# EAGLE board display_array (EAGLE 7.5.0), part 1 of 2
DRAWING_NUMBER: B001; DRAWN: Mario Blunk / Blunk electronic; PROJECT: DSKY; STATUS: R&D
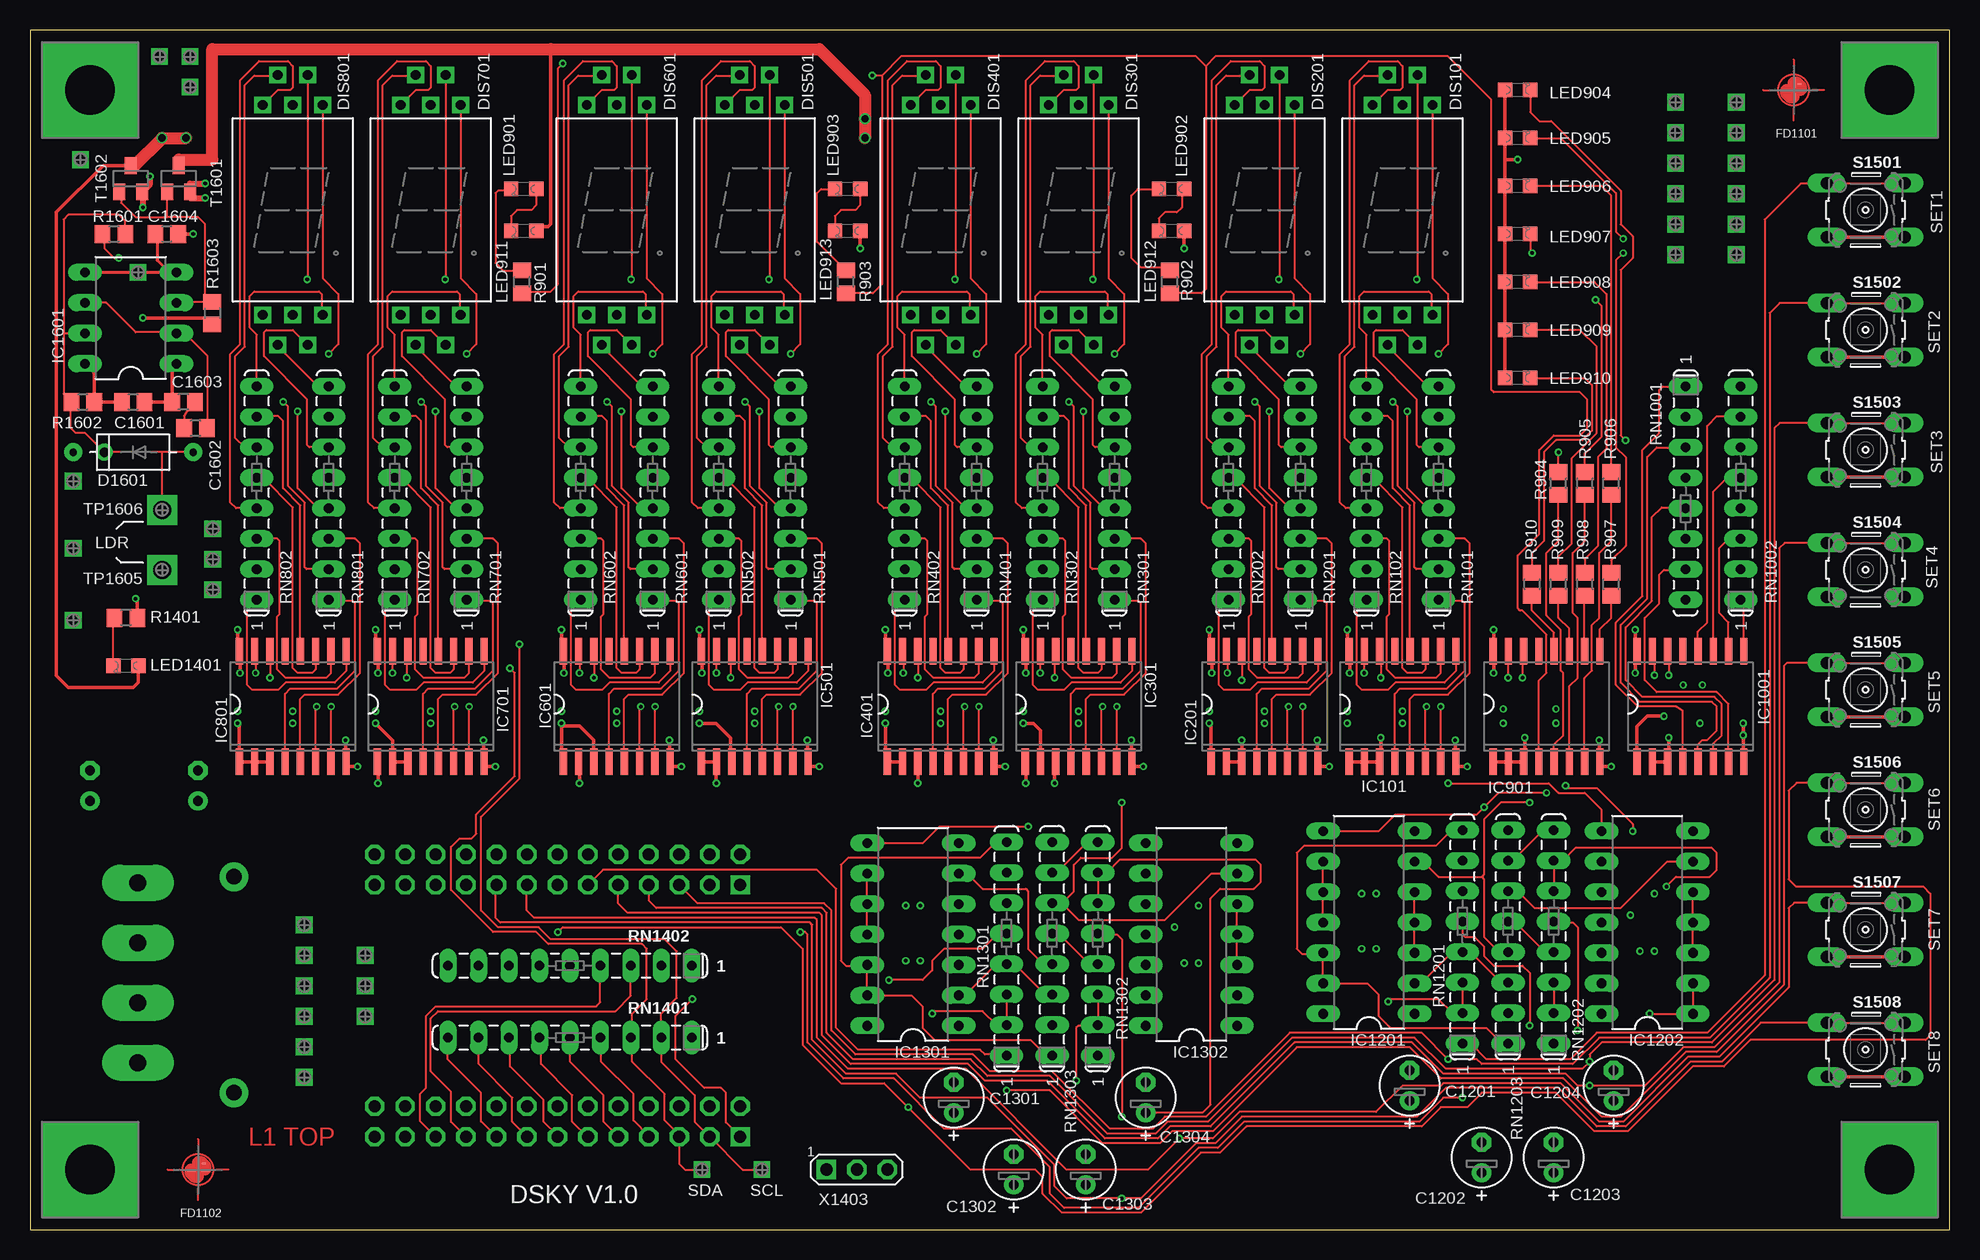
[diagram p16: board, top side]
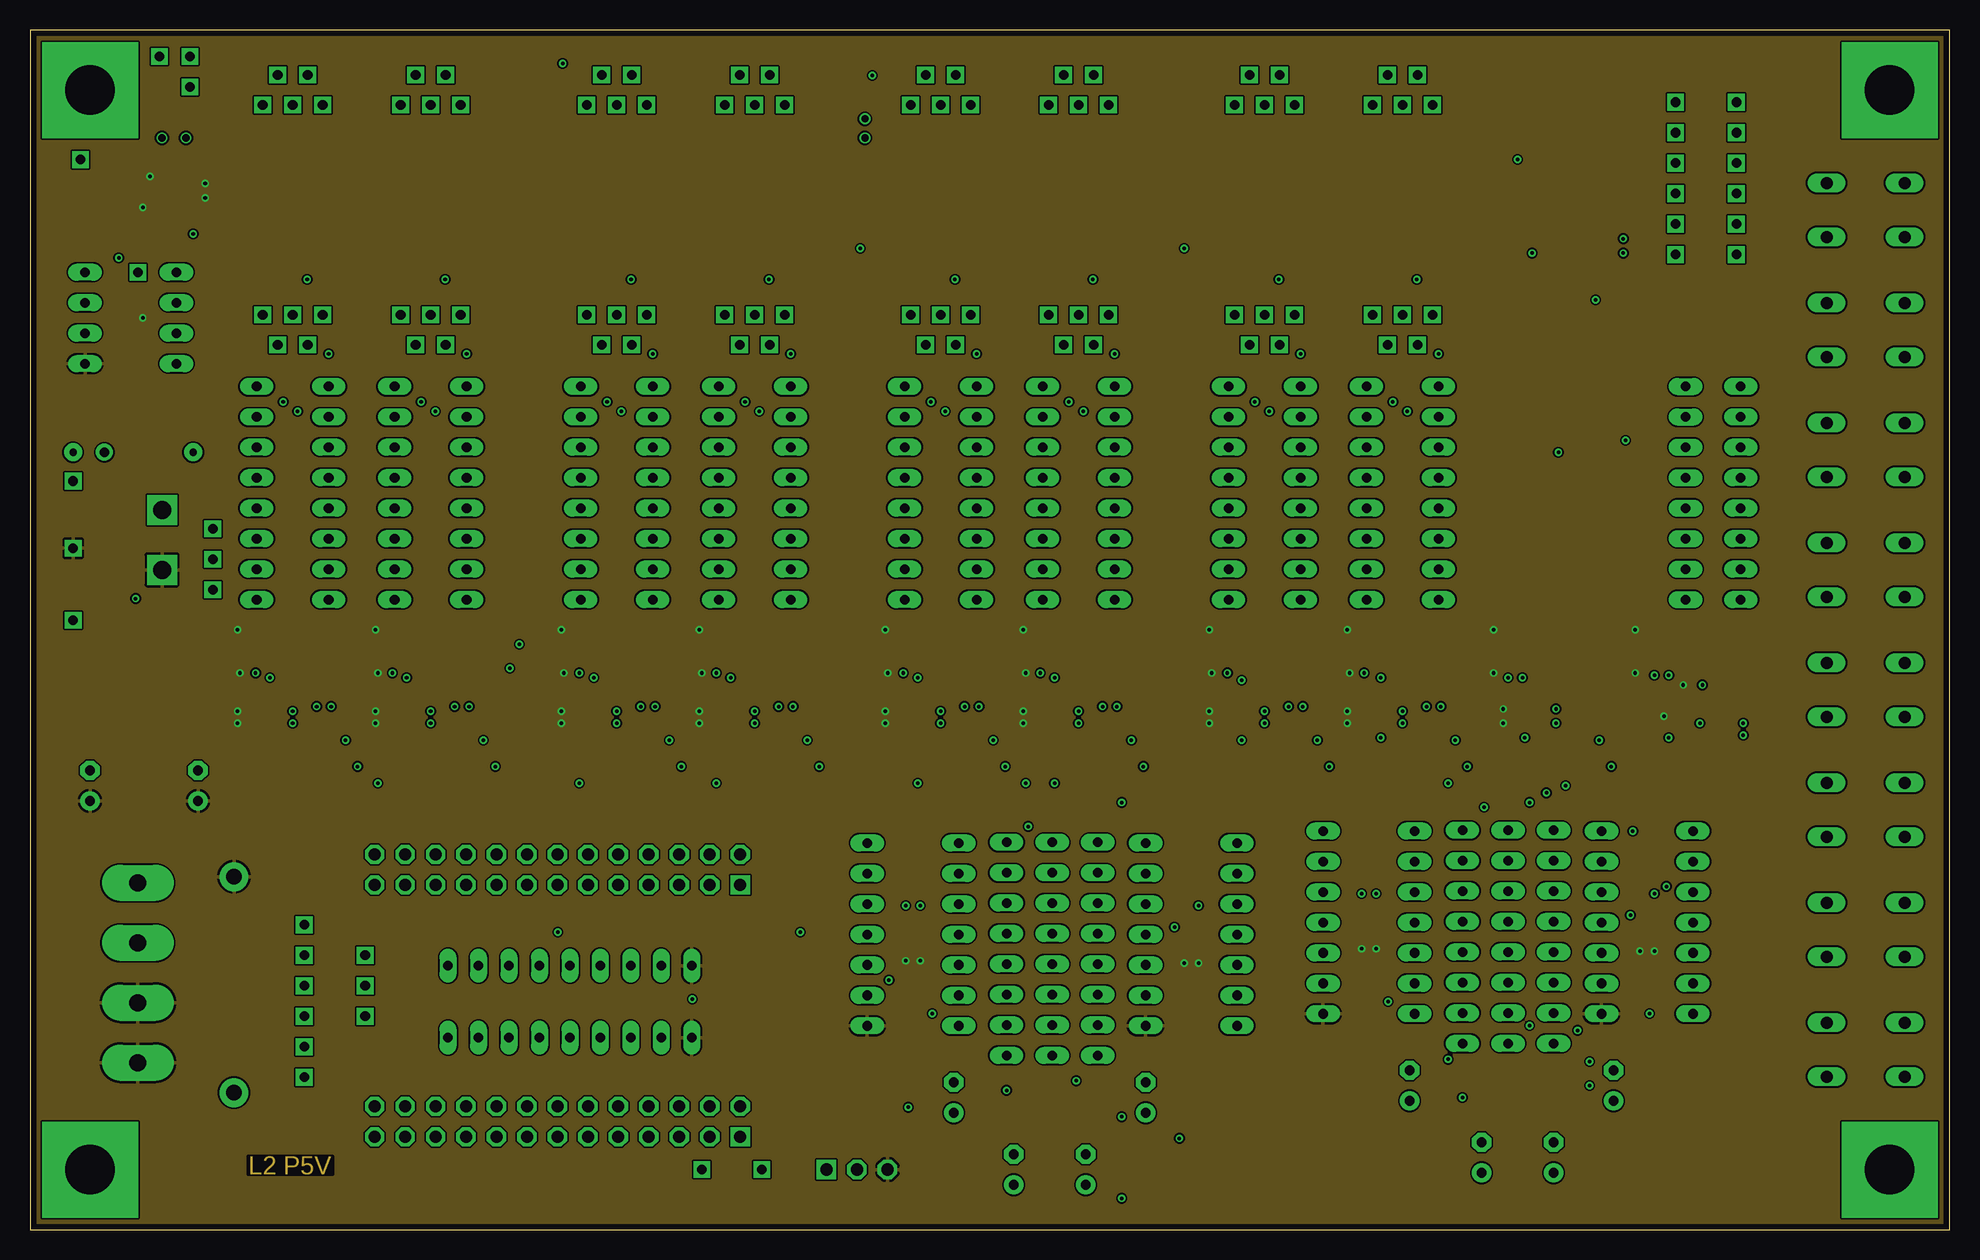
[diagram p17: board, inner layer Route2]
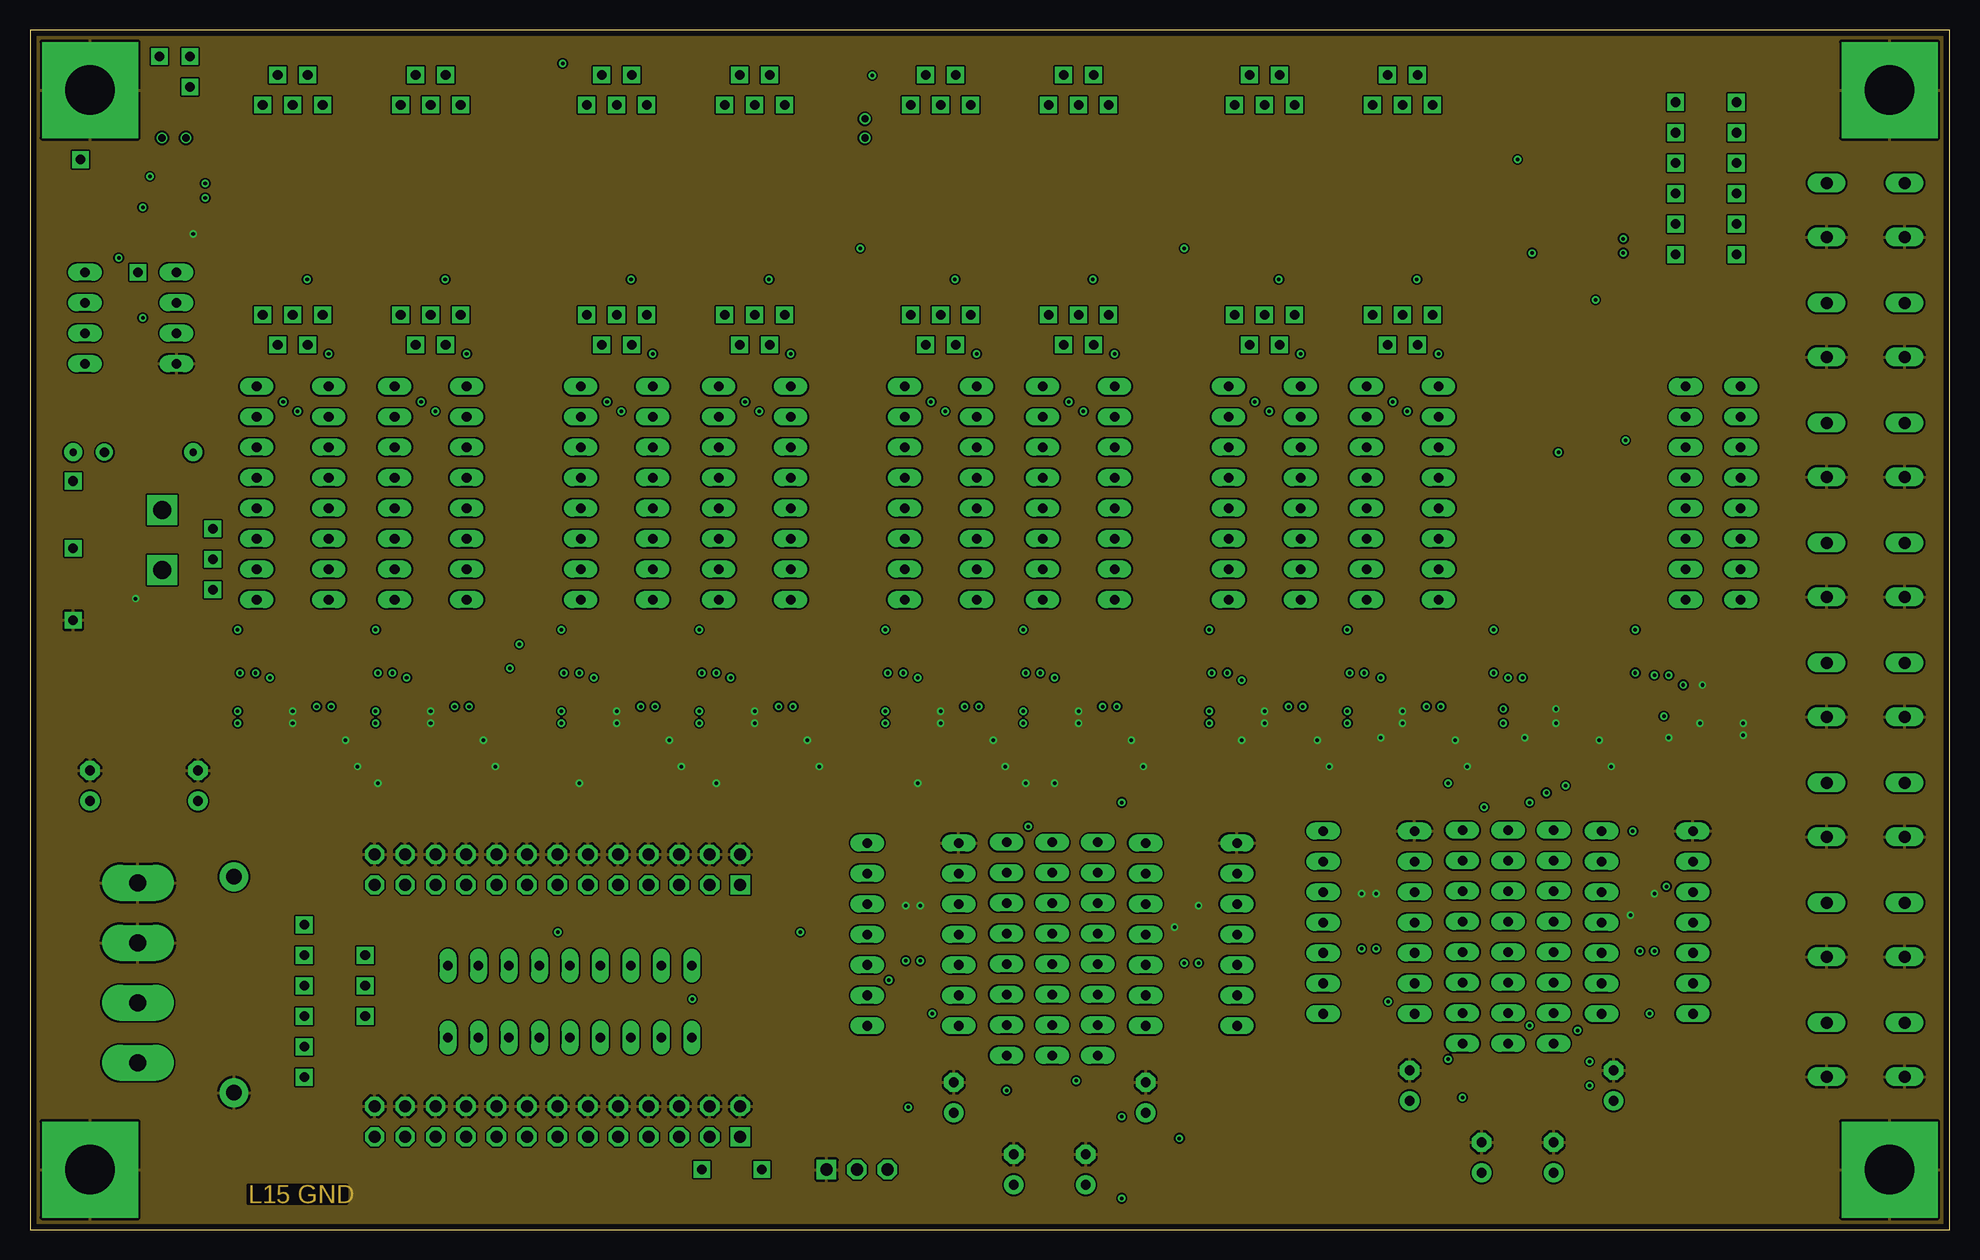
[diagram p18: board, inner layer Route15]
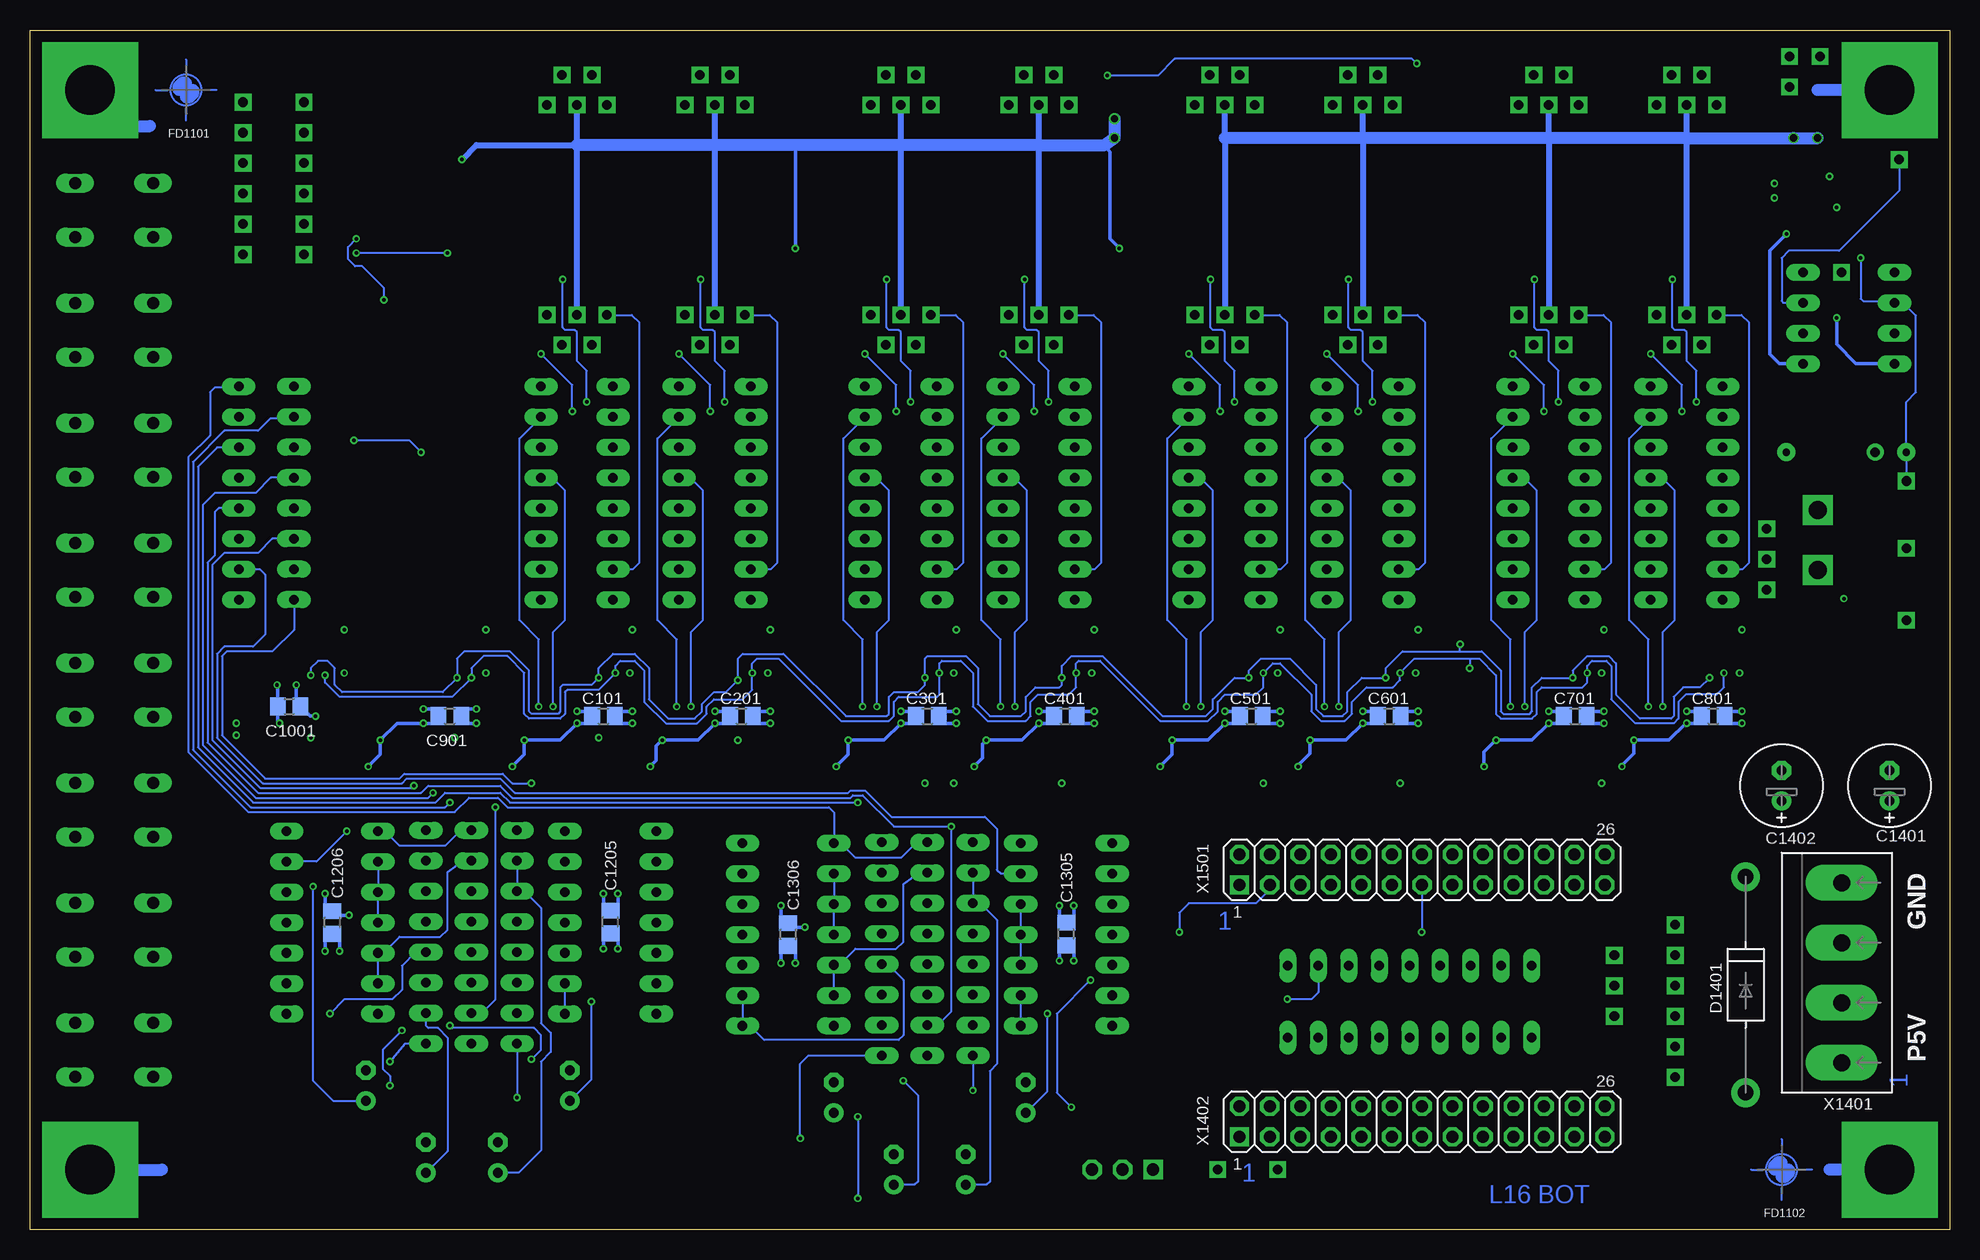
[diagram p19: board, bottom side, seen from below]

Size 160 x 100 mm. Coordinates in mm from the lower left corner, seen from the top.
Outline: 0,0 160,0 160,100 0,100 0,0
Copper layers (1+2*15+16): Top 0.018mm / dielectric 0.35mm / Route2 0.035mm / dielectric 0.65mm / Route15 0.035mm / dielectric 0.35mm / Bottom 0.018mm
Design rules "QP_ML4_std *": minimum track width 0.15mm, minimum drill 0.3mm, track to track 0.15mm, track to pad 0.15mm, pad to pad 0.15mm, via to via 0.15mm, smd to smd 0.15mm, copper to edge 0.5mm, drill to drill 0.2mm, minimum pad ring 0.3mm, minimum via ring 0.15mm, stop-mask expansion 0.1mm, vias tented up to drill 0.3mm, thermal gap 0.2mm
Net classes: 1 pwr: width 0.3 mm

## Footprints (pad centres in the part's own frame; a part is rotated, then mirrored left to right if it is on the bottom)
S_0805 = smd 1.3 x 1.5: 1 -0.95,0; 2 0.95,0
T_RADIAL_5MM_GRID_2.54MM = drill 0.8 pad 1.6: + -1.27,0 | drill 0.8 pad 1.6 octagon: - 1.27,0
T_RADIAL_7MM_GRID_2.54MM = drill 0.8 pad 1.6: + -1.27,0 | drill 0.8 pad 1.6 octagon: - 1.27,0
T_DO201_GRID_18MM = drill 1.3 pad 2.4: A -9,0; C 9,0
T_DO204_GRID_10MM = drill 0.6 pad 1.5: A -5,0; C 5,0
T_VQB71 = drill 0.8 square: 1 -2.5,-8.75; 2 -1.25,-11.25; 3 0,-8.75; 4 1.25,-11.25; 5 2.5,-8.75; 6 2.5,8.75; 7 1.25,11.25; 8 0,8.75; 9 -1.25,11.25; 10 -2.5,8.75
CROSSHAIR = smd 0.305 x 0.152: 1 0.5,0.5
4.1_PAD = drill 4.1 pad 8 square: H1 0,0
S_SOIC16 = smd 0.6 x 2.2: 1 -4.445,-4.6; 2 -3.175,-4.6; 3 -1.905,-4.6; 4 -0.635,-4.6; 5 0.635,-4.6; 6 1.905,-4.6; 7 3.175,-4.6; 8 4.445,-4.6; 9 4.445,4.6; 10 3.175,4.6; 11 1.905,4.6; 12 0.635,4.6; 13 -0.635,4.6; 14 -1.905,4.6; 15 -3.175,4.6; 16 -4.445,4.6
T_NDIP14 = drill 0.8 long: 1 -7.62,-3.81; 2 -5.08,-3.81; 3 -2.54,-3.81; 4 0,-3.81; 5 2.54,-3.81; 6 5.08,-3.81; 7 7.62,-3.81; 8 7.62,3.81; 9 5.08,3.81; 10 2.54,3.81; 11 0,3.81; 12 -2.54,3.81; 13 -5.08,3.81; 14 -7.62,3.81
T_NDIP8 = drill 0.8 long: 1 -3.82,-3.81; 2 -1.28,-3.81; 3 1.26,-3.81; 4 3.8,-3.81; 5 3.8,3.81; 6 1.26,3.81; 7 -1.28,3.81; 8 -3.82,3.81
S_0805' = smd 1.2 x 1.2: A 0,-1.05; C 0,1.05
T_SIL8 = drill 0.8 long: 1 -8.89,0; 2 -6.35,0; 3 -3.81,0; 4 -1.27,0; 5 1.27,0; 6 3.81,0; 7 6.35,0; 8 8.89,0
T_SIL9 = drill 0.8 long: 1 -10.16,0; 2 -7.62,0; 3 -5.08,0; 4 -2.54,0; 5 0,0; 6 2.54,0; 7 5.08,0; 8 7.62,0; 9 10.16,0
T_PUSH_BUTTON_6X6 = drill 1 long: 1 -3.25,2.25; 2 -3.25,-2.25; 3 3.25,2.25; 4 3.25,-2.25
S_SOT23 = smd 1 x 1.4: 1 -0.95,-1.1; 2 0.95,-1.1; 3 0,1.1
T_TEST_POINT_SMALL = drill 0.8 square: 1 0,0
T_TEST_POINT_LARGE = drill 1.5 pad 2.5 square: 1 0,0
T_WIRE_CLAMP_1X4_5MM = drill 1.4 pad 3 long: 1 -7.5,-0.02; 2 -2.5,-0.02; 3 2.5,-0.02; 4 7.5,-0.02
T_MALE_2X13_VERTICAL_GRID_2.54MM = drill 1 square: 1 -15.2,-1.27 | drill 1 octagon: 2 -15.2,1.27; 3 -12.66,-1.27; 4 -12.66,1.27; 5 -10.12,-1.27; 6 -10.12,1.27; 7 -7.58,-1.27; 8 -7.58,1.27; 9 -5.04,-1.27; 10 -5.04,1.27; 11 -2.5,-1.27; 12 -2.5,1.27; 13 0.04,-1.27; 14 0.04,1.27; 15 2.58,-1.27; 16 2.58,1.27; 17 5.12,-1.27; 18 5.12,1.27; 19 7.66,-1.27; 20 7.66,1.27; 21 10.2,-1.27; 22 10.2,1.27; 23 12.74,-1.27; 24 12.74,1.27; 25 15.28,-1.27; 26 15.28,1.27
T_MALE_3X1_VERTICAL = drill 1.016 square: 1 0,3.81 | drill 1.016 octagon: 2 0,1.27; 3 0,-1.27

## Placement (x,y rotation side)
C101  100n  [S_0805]  112.2,42.8 0 bottom
C201  100n  [S_0805]  100.7,42.8 0 bottom
C301  100n  [S_0805]  85.2,42.8 0 bottom
C401  100n  [S_0805]  73.7,42.8 0 bottom
C501  100n  [S_0805]  58.2,42.8 0 bottom
C601  100n  [S_0805]  46.7,42.8 0 bottom
C701  100n  [S_0805]  31.2,42.8 0 bottom
C801  100n  [S_0805]  19.7,42.8 0 bottom
C901  100n  [S_0805]  125,42.8 0 bottom
C1001  100n  [S_0805]  138.4,43.6 0 bottom
C1201  10u  [T_RADIAL_5MM_GRID_2.54MM]  115,12 90 top
C1202  10u  [T_RADIAL_5MM_GRID_2.54MM]  121,6 90 top
C1203  10u  [T_RADIAL_5MM_GRID_2.54MM]  127,6 90 top
C1204  10u  [T_RADIAL_5MM_GRID_2.54MM]  132,12 90 top
C1205  100n  [S_0805]  111.62,25.64 90 bottom
C1206  100n  [S_0805]  134.8,25.6 90 bottom
C1301  10u  [T_RADIAL_5MM_GRID_2.54MM]  77,11 90 top
C1302  10u  [T_RADIAL_5MM_GRID_2.54MM]  82,5 90 top
C1303  10u  [T_RADIAL_5MM_GRID_2.54MM]  88,5 90 top
C1304  10u  [T_RADIAL_5MM_GRID_2.54MM]  93,11 90 top
C1305  100n  [S_0805]  73.62,24.64 90 bottom
C1306  100n  [S_0805]  96.8,24.6 90 bottom
C1401  100u  [T_RADIAL_7MM_GRID_2.54MM]  5,37 90 bottom
C1402  100u  [T_RADIAL_7MM_GRID_2.54MM]  14,37 90 bottom
C1601  100n  [S_0805]  8.6,69 0 top
C1602  100n  [S_0805]  13.8,66.8 180 top
C1603  100n  [S_0805]  12.8,69 180 top
C1604  10n  [S_0805]  11.4,83 0 top
D1401  1N5400  [T_DO201_GRID_18MM]  17,20.4 90 bottom
D1601  BAT48  [T_DO204_GRID_10MM]  8.6,64.8 180 top
DIS101  VQB71  [T_VQB71]  114.4,85 0 top
DIS201  VQB71  [T_VQB71]  102.9,85 0 top
DIS301  VQB71  [T_VQB71]  87.4,85 0 top
DIS401  VQB71  [T_VQB71]  75.9,85 0 top
DIS501  VQB71  [T_VQB71]  60.4,85 0 top
DIS601  VQB71  [T_VQB71]  48.9,85 0 top
DIS701  VQB71  [T_VQB71]  33.4,85 0 top
DIS801  VQB71  [T_VQB71]  21.9,85 0 top
FD1101  FIDUCIAL_CROSSHAIR  [CROSSHAIR]  147,95 0 top
FD1102  FIDUCIAL_CROSSHAIR  [CROSSHAIR]  14,5 0 top
H1101  HOLE_4.1_PAD  [4.1_PAD]  5,95 0 top
H1102  HOLE_4.1_PAD  [4.1_PAD]  5,5 0 top
H1103  HOLE_4.1_PAD  [4.1_PAD]  155,5 0 top
H1104  HOLE_4.1_PAD  [4.1_PAD]  155,95 0 top
IC101  PCF8574T  [S_SOIC16]  114.4,43.6 0 top
IC201  PCF8574T  [S_SOIC16]  102.9,43.6 0 top
IC301  PCF8574T  [S_SOIC16]  87.4,43.6 0 top
IC401  PCF8574T  [S_SOIC16]  75.9,43.6 0 top
IC501  PCF8574T  [S_SOIC16]  60.4,43.6 0 top
IC601  PCF8574T  [S_SOIC16]  48.9,43.6 0 top
IC701  PCF8574T  [S_SOIC16]  33.4,43.6 0 top
IC801  PCF8574T  [S_SOIC16]  21.9,43.6 0 top
IC901  PCF8574AT  [S_SOIC16]  126.4,43.6 0 top
IC1001  PCF8574AT  [S_SOIC16]  138.4,43.6 0 top
IC1201  SN7400N  [T_NDIP14]  111.6,25.6 90 top
IC1202  SN7400N  [T_NDIP14]  134.8,25.6 90 top
IC1301  SN7400N  [T_NDIP14]  73.6,24.6 90 top
IC1302  SN7400N  [T_NDIP14]  96.8,24.6 90 top
IC1601  NE555V  [T_NDIP8]  8.4,76 90 top
LED901  red  [S_0805']  41.15,86.75 90 top
LED902  red  [S_0805']  95.15,86.75 90 top
LED903  red  [S_0805']  68.15,86.75 90 top
LED904  green  [S_0805']  124,95 270 top
LED905  green  [S_0805']  124,91 270 top
LED906  yellow  [S_0805']  124,87 270 top
LED907  yellow  [S_0805']  124,83 270 top
LED908  red  [S_0805']  124,79 270 top
LED909  blue  [S_0805']  124,75 270 top
LED910  blue  [S_0805']  124,71 270 top
LED911  red  [S_0805']  41.15,83.25 90 top
LED912  red  [S_0805']  95.15,83.25 90 top
LED913  red  [S_0805']  68.15,83.25 90 top
LED1401  green  [S_0805']  8,47 90 top
R901  1k5  [S_0805]  41,79 90 top
R902  1k5  [S_0805]  95,79 90 top
R903  1k5  [S_0805]  68,79 90 top
R904  750  [S_0805]  127.4,62.2 90 top
R905  750  [S_0805]  129.6,62.2 90 top
R906  2k2  [S_0805]  131.8,62.2 90 top
R907  2k2  [S_0805]  131.8,53.8 90 top
R908  3k3  [S_0805]  129.6,53.8 90 top
R909  2k4  [S_0805]  127.4,53.8 90 top
R910  2k4  [S_0805]  125.2,53.8 90 top
R1401  220  [S_0805]  8,51 180 top
R1601  10k  [S_0805]  7,83 0 top
R1602  470k  [S_0805]  4.4,69 0 top
R1603  1k  [S_0805]  15.2,76.4 270 top
RN101  100  [T_SIL8]  117.4,61.4 90 top
RN102  100  [T_SIL8]  111.4,61.4 90 top
RN201  100  [T_SIL8]  105.9,61.4 90 top
RN202  100  [T_SIL8]  99.9,61.4 90 top
RN301  100  [T_SIL8]  90.4,61.4 90 top
RN302  100  [T_SIL8]  84.4,61.4 90 top
RN401  100  [T_SIL8]  78.9,61.4 90 top
RN402  100  [T_SIL8]  72.9,61.4 90 top
RN501  100  [T_SIL8]  63.4,61.4 90 top
RN502  100  [T_SIL8]  57.4,61.4 90 top
RN601  100  [T_SIL8]  51.9,61.4 90 top
RN602  100  [T_SIL8]  45.9,61.4 90 top
RN701  100  [T_SIL8]  36.4,61.4 90 top
RN702  100  [T_SIL8]  30.4,61.4 90 top
RN801  100  [T_SIL8]  24.9,61.4 90 top
RN802  100  [T_SIL8]  18.9,61.4 90 top
RN1001  100  [T_SIL8]  138,61.4 270 top
RN1002  100  [T_SIL8]  142.6,61.4 90 top
RN1201  220  [T_SIL8]  119.4,24.4 90 top
RN1202  220  [T_SIL8]  127,24.4 90 top
RN1203  4k7  [T_SIL8]  123.2,24.4 90 top
RN1301  220  [T_SIL8]  81.4,23.4 90 top
RN1302  220  [T_SIL8]  89,23.4 90 top
RN1303  4k7  [T_SIL8]  85.2,23.4 90 top
RN1401  10k  [T_SIL9]  45,16 180 top
RN1402  10k  [T_SIL9]  45,22 180 top
S1501  set  [T_PUSH_BUTTON_6X6]  153,85 180 top
S1502  set  [T_PUSH_BUTTON_6X6]  153,75 180 top
S1503  set  [T_PUSH_BUTTON_6X6]  153,65 180 top
S1504  set  [T_PUSH_BUTTON_6X6]  153,55 180 top
S1505  set  [T_PUSH_BUTTON_6X6]  153,45 180 top
S1506  set  [T_PUSH_BUTTON_6X6]  153,35 180 top
S1507  set  [T_PUSH_BUTTON_6X6]  153,25 180 top
S1508  set  [T_PUSH_BUTTON_6X6]  153,15 180 top
T1601  NX2301P  [S_SOT23]  12.4,87.6 0 top
T1602  NX2301P  [S_SOT23]  8.4,87.6 0 top
TP1101  TEST_POINT_T_SMALL  [T_TEST_POINT_SMALL]  142.24,93.98 0 top
TP1102  TEST_POINT_T_SMALL  [T_TEST_POINT_SMALL]  137.16,81.28 0 top
TP1103  TEST_POINT_T_SMALL  [T_TEST_POINT_SMALL]  137.16,83.82 0 top
TP1104  TEST_POINT_T_SMALL  [T_TEST_POINT_SMALL]  137.16,86.36 0 top
TP1105  TEST_POINT_T_SMALL  [T_TEST_POINT_SMALL]  137.16,88.9 0 top
TP1106  TEST_POINT_T_SMALL  [T_TEST_POINT_SMALL]  137.16,91.44 90 top
TP1107  TEST_POINT_T_SMALL  [T_TEST_POINT_SMALL]  137.16,93.98 0 top
TP1108  TEST_POINT_T_SMALL  [T_TEST_POINT_SMALL]  22.86,22.86 0 top
TP1109  TEST_POINT_T_SMALL  [T_TEST_POINT_SMALL]  22.86,25.4 0 top
TP1110  TEST_POINT_T_SMALL  [T_TEST_POINT_SMALL]  142.24,81.28 0 top
TP1111  TEST_POINT_T_SMALL  [T_TEST_POINT_SMALL]  142.24,83.82 0 top
TP1112  TEST_POINT_T_SMALL  [T_TEST_POINT_SMALL]  142.24,86.36 0 top
TP1113  TEST_POINT_T_SMALL  [T_TEST_POINT_SMALL]  142.24,88.9 0 top
TP1114  TEST_POINT_T_SMALL  [T_TEST_POINT_SMALL]  142.24,91.44 0 top
TP1115  TEST_POINT_T_SMALL  [T_TEST_POINT_SMALL]  27.94,17.78 0 top
TP1116  TEST_POINT_T_SMALL  [T_TEST_POINT_SMALL]  27.94,20.32 0 top
TP1117  TEST_POINT_T_SMALL  [T_TEST_POINT_SMALL]  27.94,22.86 0 top
TP1118  TEST_POINT_T_SMALL  [T_TEST_POINT_SMALL]  22.86,12.7 0 top
TP1119  TEST_POINT_T_SMALL  [T_TEST_POINT_SMALL]  22.86,15.24 0 top
TP1120  TEST_POINT_T_SMALL  [T_TEST_POINT_SMALL]  22.86,17.78 0 top
TP1121  TEST_POINT_T_SMALL  [T_TEST_POINT_SMALL]  22.86,20.32 0 top
TP1122  TEST_POINT_T_SMALL  [T_TEST_POINT_SMALL]  15.24,53.34 0 top
TP1123  TEST_POINT_T_SMALL  [T_TEST_POINT_SMALL]  15.24,55.88 0 top
TP1124  TEST_POINT_T_SMALL  [T_TEST_POINT_SMALL]  15.24,58.42 0 top
TP1125  TEST_POINT_T_SMALL  [T_TEST_POINT_SMALL]  13.34,95.25 0 top
TP1126  TEST_POINT_T_SMALL  [T_TEST_POINT_SMALL]  10.79,97.79 0 top
TP1127  TEST_POINT_T_SMALL  [T_TEST_POINT_SMALL]  13.34,97.79 0 top
TP1401  TEST_POINT_T_SMALL  [T_TEST_POINT_SMALL]  61,5 0 top
TP1402  TEST_POINT_T_SMALL  [T_TEST_POINT_SMALL]  56,5 0 top
TP1601  TEST_POINT_T_SMALL  [T_TEST_POINT_SMALL]  3.6,62.4 0 top
TP1602  TEST_POINT_T_SMALL  [T_TEST_POINT_SMALL]  3.6,56.8 0 top
TP1603  TEST_POINT_T_SMALL  [T_TEST_POINT_SMALL]  3.6,50.8 0 top
TP1604  TEST_POINT_T_SMALL  [T_TEST_POINT_SMALL]  9,79.8 0 top
TP1605  TEST_POINT_T_LARGE  [T_TEST_POINT_LARGE]  11,55 0 top
TP1606  TEST_POINT_T_LARGE  [T_TEST_POINT_LARGE]  11,60 0 top
TP1607  TEST_POINT_T_SMALL  [T_TEST_POINT_SMALL]  4.2,89.2 0 top
U$1  [A4_LANDSCAPE]  -49.6,-63.2 0 top  (outside the outline)
X1401  CLAMP_1X4-T-5MM  [T_WIRE_CLAMP_1X4_5MM]  9,21.4 90 bottom
X1402  MALE_2X13-T-VERTICAL_2.54MM  [T_MALE_2X13_VERTICAL_GRID_2.54MM]  44,9 0 bottom
X1403  MALE_1X3  [T_MALE_3X1_VERTICAL]  70.2,5 90 top
X1501  MALE_2X13-T-VERTICAL_2.54MM  [T_MALE_2X13_VERTICAL_GRID_2.54MM]  44,30 0 bottom